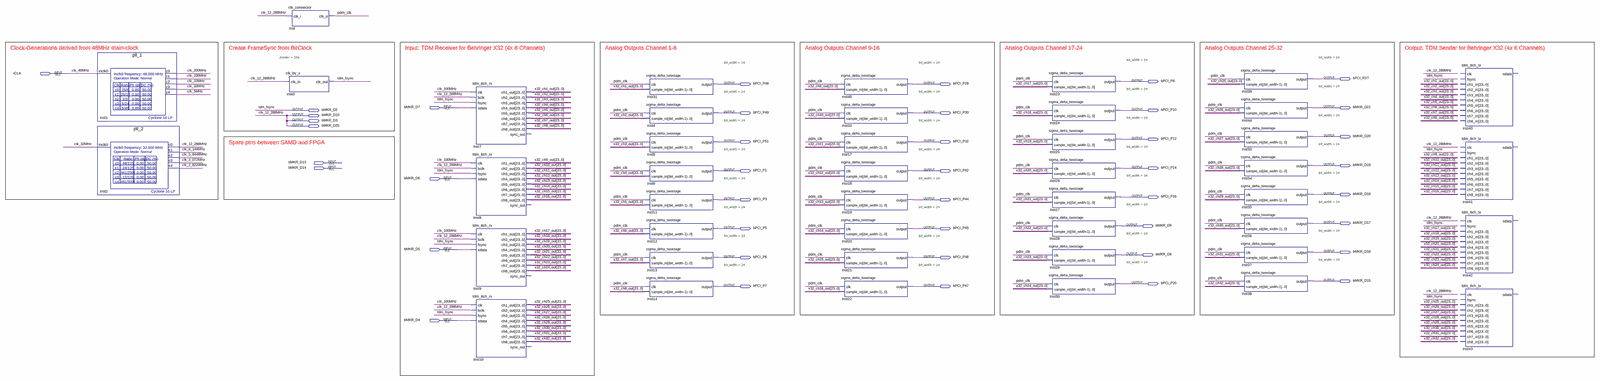
[diagram p0: schematic sheet, whole]
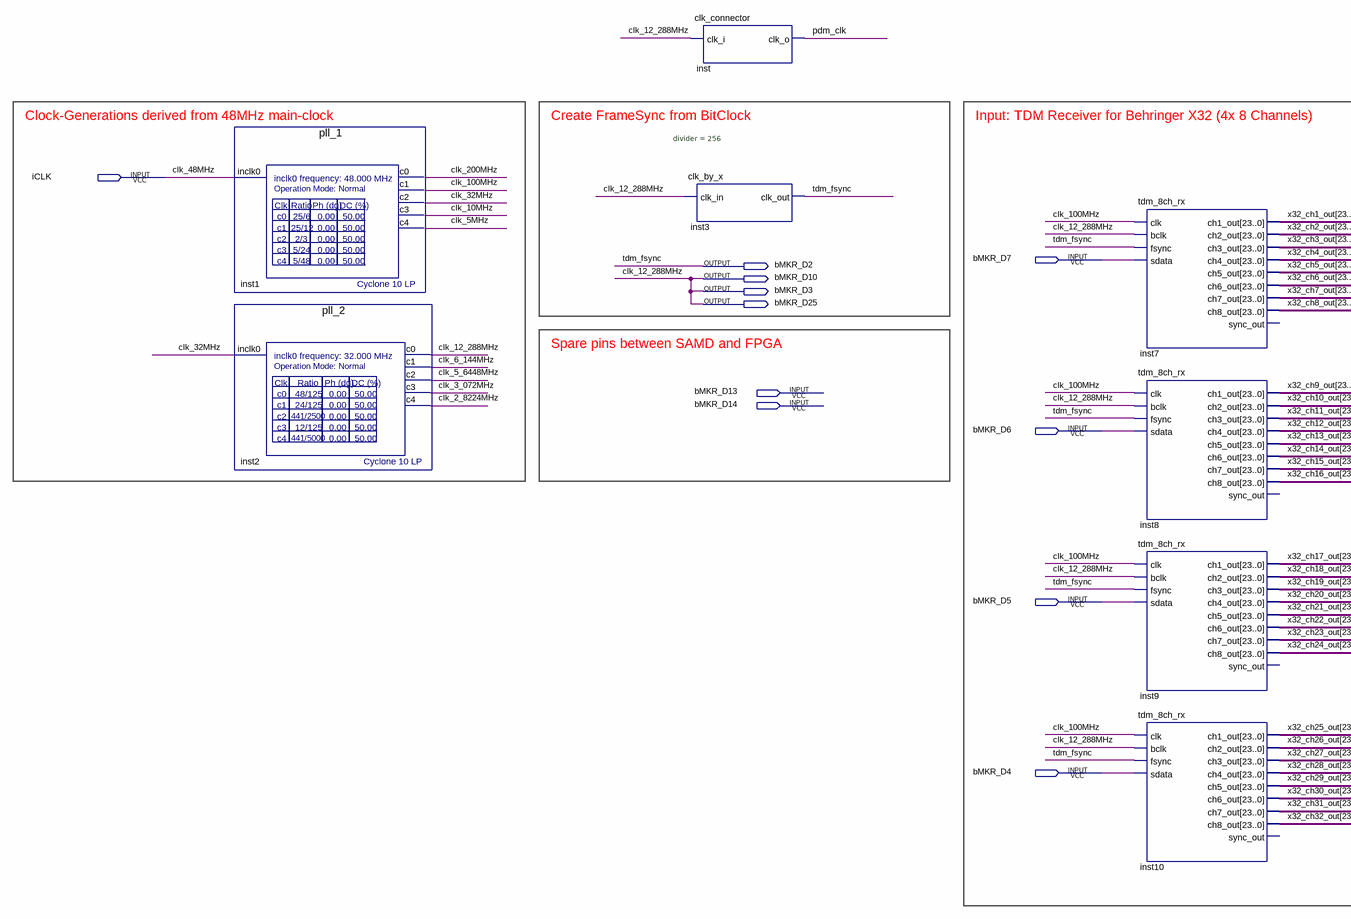
[diagram p1: schematic sheet, left part]
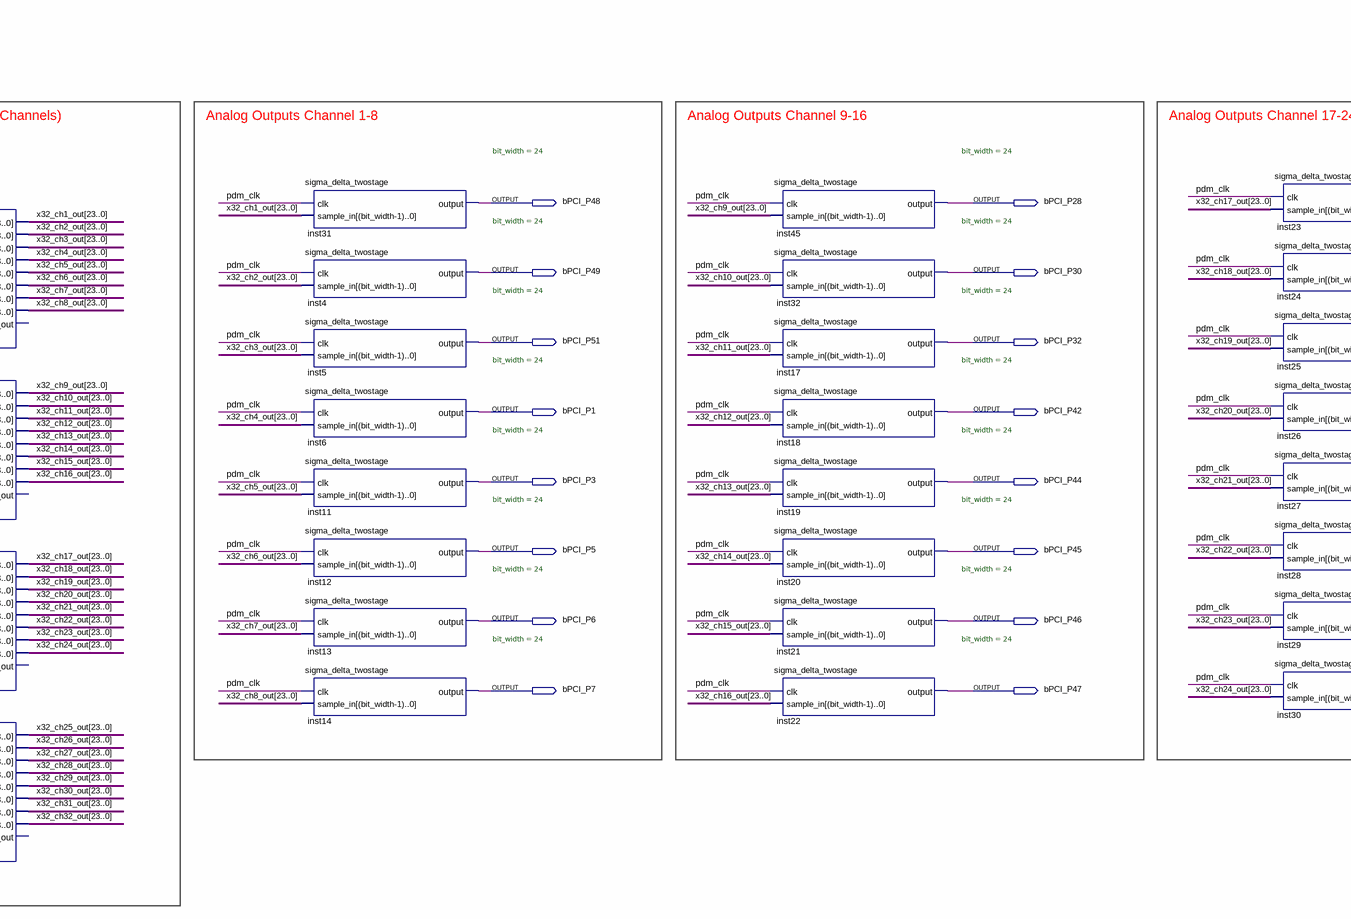
[diagram p2: schematic sheet, centre part]
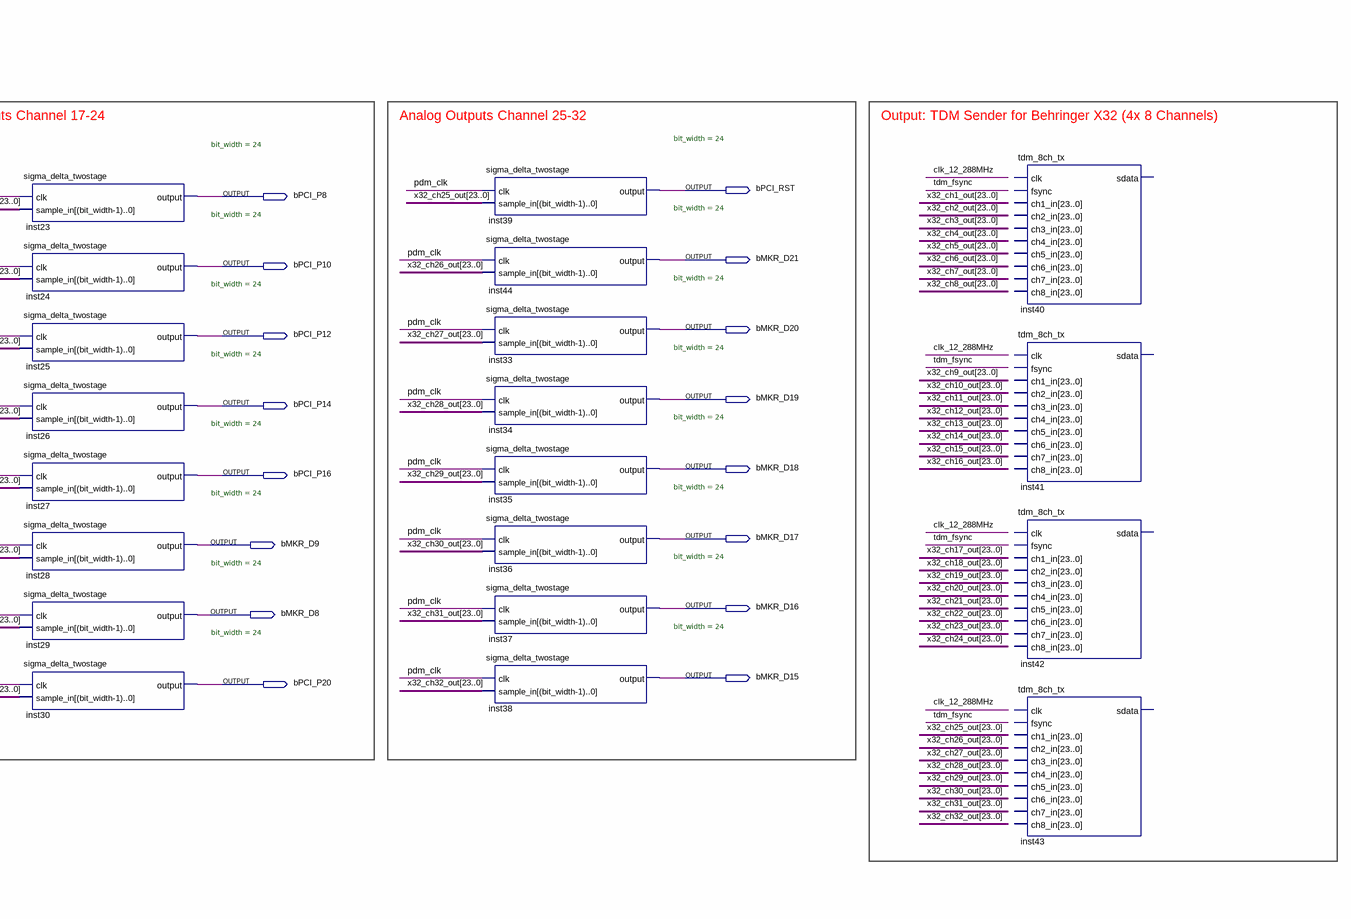
[diagram p3: schematic sheet, right part]
// Quartus schematic Audioplayer.bdf as structural Verilog: 44 symbols, 43 pins
module Audioplayer (
  input  iCLK,
  input  bMKR_D7,
  input  bMKR_D13,
  input  bMKR_D14,
  input  bMKR_D6,
  input  bMKR_D5,
  input  bMKR_D4,
  output bPCI_RST,
  output bPCI_P8,
  output bPCI_P48,
  output bPCI_P28,
  output bMKR_D21,
  output bMKR_D2,
  output bPCI_P10,
  output bPCI_P49,
  output bPCI_P30,
  output bMKR_D10,
  output bMKR_D3,
  output bMKR_D25,
  output bMKR_D20,
  output bPCI_P12,
  output bPCI_P51,
  output bPCI_P32,
  output bMKR_D19,
  output bPCI_P14,
  output bPCI_P1,
  output bPCI_P42,
  output bMKR_D18,
  output bPCI_P16,
  output bPCI_P3,
  output bPCI_P44,
  output bMKR_D17,
  output bMKR_D9,
  output bPCI_P5,
  output bPCI_P45,
  output bMKR_D16,
  output bMKR_D8,
  output bPCI_P6,
  output bPCI_P46,
  output bMKR_D15,
  output bPCI_P20,
  output bPCI_P7,
  output bPCI_P47
);

  wire clk_2_8224MHz, clk_3_072MHz, clk_5_6448MHz, clk_5MHz, clk_6_144MHz, clk_10MHz, clk_32MHz, clk_100MHz,
       clk_200MHz, pdm_clk;
  wire [23:0] x32_ch1_out, x32_ch2_out, x32_ch3_out, x32_ch4_out, x32_ch5_out, x32_ch6_out, x32_ch7_out,
       x32_ch8_out, x32_ch9_out, x32_ch10_out, x32_ch11_out, x32_ch12_out, x32_ch13_out, x32_ch14_out,
       x32_ch15_out, x32_ch16_out, x32_ch17_out, x32_ch18_out, x32_ch19_out, x32_ch20_out, x32_ch21_out,
       x32_ch22_out, x32_ch23_out, x32_ch24_out, x32_ch25_out, x32_ch26_out, x32_ch27_out, x32_ch28_out,
       x32_ch29_out, x32_ch30_out, x32_ch31_out, x32_ch32_out;

  pll_1 inst1 (.inclk0(iCLK), .c0(clk_200MHz), .c1(clk_100MHz), .c2(clk_32MHz), .c3(clk_10MHz), .c4(clk_5MHz));
  pll_2 inst2 (
    .inclk0(clk_32MHz), .c0(bMKR_D3), .c1(clk_6_144MHz), .c2(clk_5_6448MHz), .c3(clk_3_072MHz),
    .c4(clk_2_8224MHz));
  clk_by_x #(.divider(256)) inst3 (.clk_in(bMKR_D3), .clk_out(bMKR_D2));
  clk_connector inst (.clk_i(bMKR_D3), .clk_o(pdm_clk));
  tdm_8ch_rx inst7 (
    .clk(clk_100MHz), .bclk(bMKR_D3), .fsync(bMKR_D2), .sdata(bMKR_D7), .ch1_out(x32_ch1_out),
    .ch2_out(x32_ch2_out), .ch3_out(x32_ch3_out), .ch4_out(x32_ch4_out), .ch5_out(x32_ch5_out),
    .ch6_out(x32_ch6_out), .ch7_out(x32_ch7_out), .ch8_out(x32_ch8_out));  // open: sync_out
  tdm_8ch_rx inst8 (
    .clk(clk_100MHz), .bclk(bMKR_D3), .fsync(bMKR_D2), .sdata(bMKR_D6), .ch1_out(x32_ch9_out),
    .ch2_out(x32_ch10_out), .ch3_out(x32_ch11_out), .ch4_out(x32_ch12_out), .ch5_out(x32_ch13_out),
    .ch6_out(x32_ch14_out), .ch7_out(x32_ch15_out), .ch8_out(x32_ch16_out));  // open: sync_out
  tdm_8ch_rx inst9 (
    .clk(clk_100MHz), .bclk(bMKR_D3), .fsync(bMKR_D2), .sdata(bMKR_D5), .ch1_out(x32_ch17_out),
    .ch2_out(x32_ch18_out), .ch3_out(x32_ch19_out), .ch4_out(x32_ch20_out), .ch5_out(x32_ch21_out),
    .ch6_out(x32_ch22_out), .ch7_out(x32_ch23_out), .ch8_out(x32_ch24_out));  // open: sync_out
  tdm_8ch_rx inst10 (
    .clk(clk_100MHz), .bclk(bMKR_D3), .fsync(bMKR_D2), .sdata(bMKR_D4), .ch1_out(x32_ch25_out),
    .ch2_out(x32_ch26_out), .ch3_out(x32_ch27_out), .ch4_out(x32_ch28_out), .ch5_out(x32_ch29_out),
    .ch6_out(x32_ch30_out), .ch7_out(x32_ch31_out), .ch8_out(x32_ch32_out));  // open: sync_out
  sigma_delta_twostage #(.bit_width(24)) inst31 (.clk(pdm_clk), .sample_in(x32_ch1_out), .\output (bPCI_P48));
  sigma_delta_twostage #(.bit_width(24)) inst4 (.clk(pdm_clk), .sample_in(x32_ch2_out), .\output (bPCI_P49));
  sigma_delta_twostage #(.bit_width(24)) inst5 (.clk(pdm_clk), .sample_in(x32_ch3_out), .\output (bPCI_P51));
  sigma_delta_twostage #(.bit_width(24)) inst6 (.clk(pdm_clk), .sample_in(x32_ch4_out), .\output (bPCI_P1));
  sigma_delta_twostage #(.bit_width(24)) inst11 (.clk(pdm_clk), .sample_in(x32_ch5_out), .\output (bPCI_P3));
  sigma_delta_twostage #(.bit_width(24)) inst12 (.clk(pdm_clk), .sample_in(x32_ch6_out), .\output (bPCI_P5));
  sigma_delta_twostage #(.bit_width(24)) inst13 (.clk(pdm_clk), .sample_in(x32_ch7_out), .\output (bPCI_P6));
  sigma_delta_twostage #(.bit_width(24)) inst14 (.clk(pdm_clk), .sample_in(x32_ch8_out), .\output (bPCI_P7));
  sigma_delta_twostage #(.bit_width(24)) inst45 (.clk(pdm_clk), .sample_in(x32_ch9_out), .\output (bPCI_P28));
  sigma_delta_twostage #(.bit_width(24)) inst32 (.clk(pdm_clk), .sample_in(x32_ch10_out), .\output (bPCI_P30));
  sigma_delta_twostage #(.bit_width(24)) inst17 (.clk(pdm_clk), .sample_in(x32_ch11_out), .\output (bPCI_P32));
  sigma_delta_twostage #(.bit_width(24)) inst18 (.clk(pdm_clk), .sample_in(x32_ch12_out), .\output (bPCI_P42));
  sigma_delta_twostage #(.bit_width(24)) inst19 (.clk(pdm_clk), .sample_in(x32_ch13_out), .\output (bPCI_P44));
  sigma_delta_twostage #(.bit_width(24)) inst20 (.clk(pdm_clk), .sample_in(x32_ch14_out), .\output (bPCI_P45));
  sigma_delta_twostage #(.bit_width(24)) inst21 (.clk(pdm_clk), .sample_in(x32_ch15_out), .\output (bPCI_P46));
  sigma_delta_twostage #(.bit_width(24)) inst22 (.clk(pdm_clk), .sample_in(x32_ch16_out), .\output (bPCI_P47));
  sigma_delta_twostage #(.bit_width(24)) inst23 (.clk(pdm_clk), .sample_in(x32_ch17_out), .\output (bPCI_P8));
  sigma_delta_twostage #(.bit_width(24)) inst24 (.clk(pdm_clk), .sample_in(x32_ch18_out), .\output (bPCI_P10));
  sigma_delta_twostage #(.bit_width(24)) inst25 (.clk(pdm_clk), .sample_in(x32_ch19_out), .\output (bPCI_P12));
  sigma_delta_twostage #(.bit_width(24)) inst26 (.clk(pdm_clk), .sample_in(x32_ch20_out), .\output (bPCI_P14));
  sigma_delta_twostage #(.bit_width(24)) inst27 (.clk(pdm_clk), .sample_in(x32_ch21_out), .\output (bPCI_P16));
  sigma_delta_twostage #(.bit_width(24)) inst28 (.clk(pdm_clk), .sample_in(x32_ch22_out), .\output (bMKR_D9));
  sigma_delta_twostage #(.bit_width(24)) inst29 (.clk(pdm_clk), .sample_in(x32_ch23_out), .\output (bMKR_D8));
  sigma_delta_twostage #(.bit_width(24)) inst30 (.clk(pdm_clk), .sample_in(x32_ch24_out), .\output (bPCI_P20));
  sigma_delta_twostage #(.bit_width(24)) inst39 (.clk(pdm_clk), .sample_in(x32_ch25_out), .\output (bPCI_RST));
  sigma_delta_twostage #(.bit_width(24)) inst44 (.clk(pdm_clk), .sample_in(x32_ch26_out), .\output (bMKR_D21));
  sigma_delta_twostage #(.bit_width(24)) inst33 (.clk(pdm_clk), .sample_in(x32_ch27_out), .\output (bMKR_D20));
  sigma_delta_twostage #(.bit_width(24)) inst34 (.clk(pdm_clk), .sample_in(x32_ch28_out), .\output (bMKR_D19));
  sigma_delta_twostage #(.bit_width(24)) inst35 (.clk(pdm_clk), .sample_in(x32_ch29_out), .\output (bMKR_D18));
  sigma_delta_twostage #(.bit_width(24)) inst36 (.clk(pdm_clk), .sample_in(x32_ch30_out), .\output (bMKR_D17));
  sigma_delta_twostage #(.bit_width(24)) inst37 (.clk(pdm_clk), .sample_in(x32_ch31_out), .\output (bMKR_D16));
  sigma_delta_twostage #(.bit_width(24)) inst38 (.clk(pdm_clk), .sample_in(x32_ch32_out), .\output (bMKR_D15));
  tdm_8ch_tx inst40 ();  // open: clk, fsync, ch1_in, ch2_in, ch3_in, ch4_in, ch5_in, ch6_in, ch7_in, ch8_in, sdata
  tdm_8ch_tx inst41 ();  // open: clk, fsync, ch1_in, ch2_in, ch3_in, ch4_in, ch5_in, ch6_in, ch7_in, ch8_in, sdata
  tdm_8ch_tx inst42 ();  // open: clk, fsync, ch1_in, ch2_in, ch3_in, ch4_in, ch5_in, ch6_in, ch7_in, ch8_in, sdata
  tdm_8ch_tx inst43 ();  // open: clk, fsync, ch1_in, ch2_in, ch3_in, ch4_in, ch5_in, ch6_in, ch7_in, ch8_in, sdata

  assign bMKR_D10 = bMKR_D3;
  assign bMKR_D25 = bMKR_D3;

  // Other names for the same wires on the sheet: clk_12_288MHz = bMKR_D3; clk_48MHz = iCLK; tdm_fsync = bMKR_D2

  // Notes on the sheet:
  //   Clock-Generations derived from 48MHz main-clock
  //   Create FrameSync from BitClock
  //   Input: TDM Receiver for Behringer X32 (4x 8 Channels)
  //   Analog Outputs Channel 1-8
  //   Analog Outputs Channel 9-16
  //   Analog Outputs Channel 17-24
  //   Analog Outputs Channel 25-32
  //   Output: TDM Sender for Behringer X32 (4x 8 Channels)
  //   Spare pins between SAMD and FPGA
endmodule
